# EAGLE design MB_Nano_V3_2 (EAGLE 9.5.2)
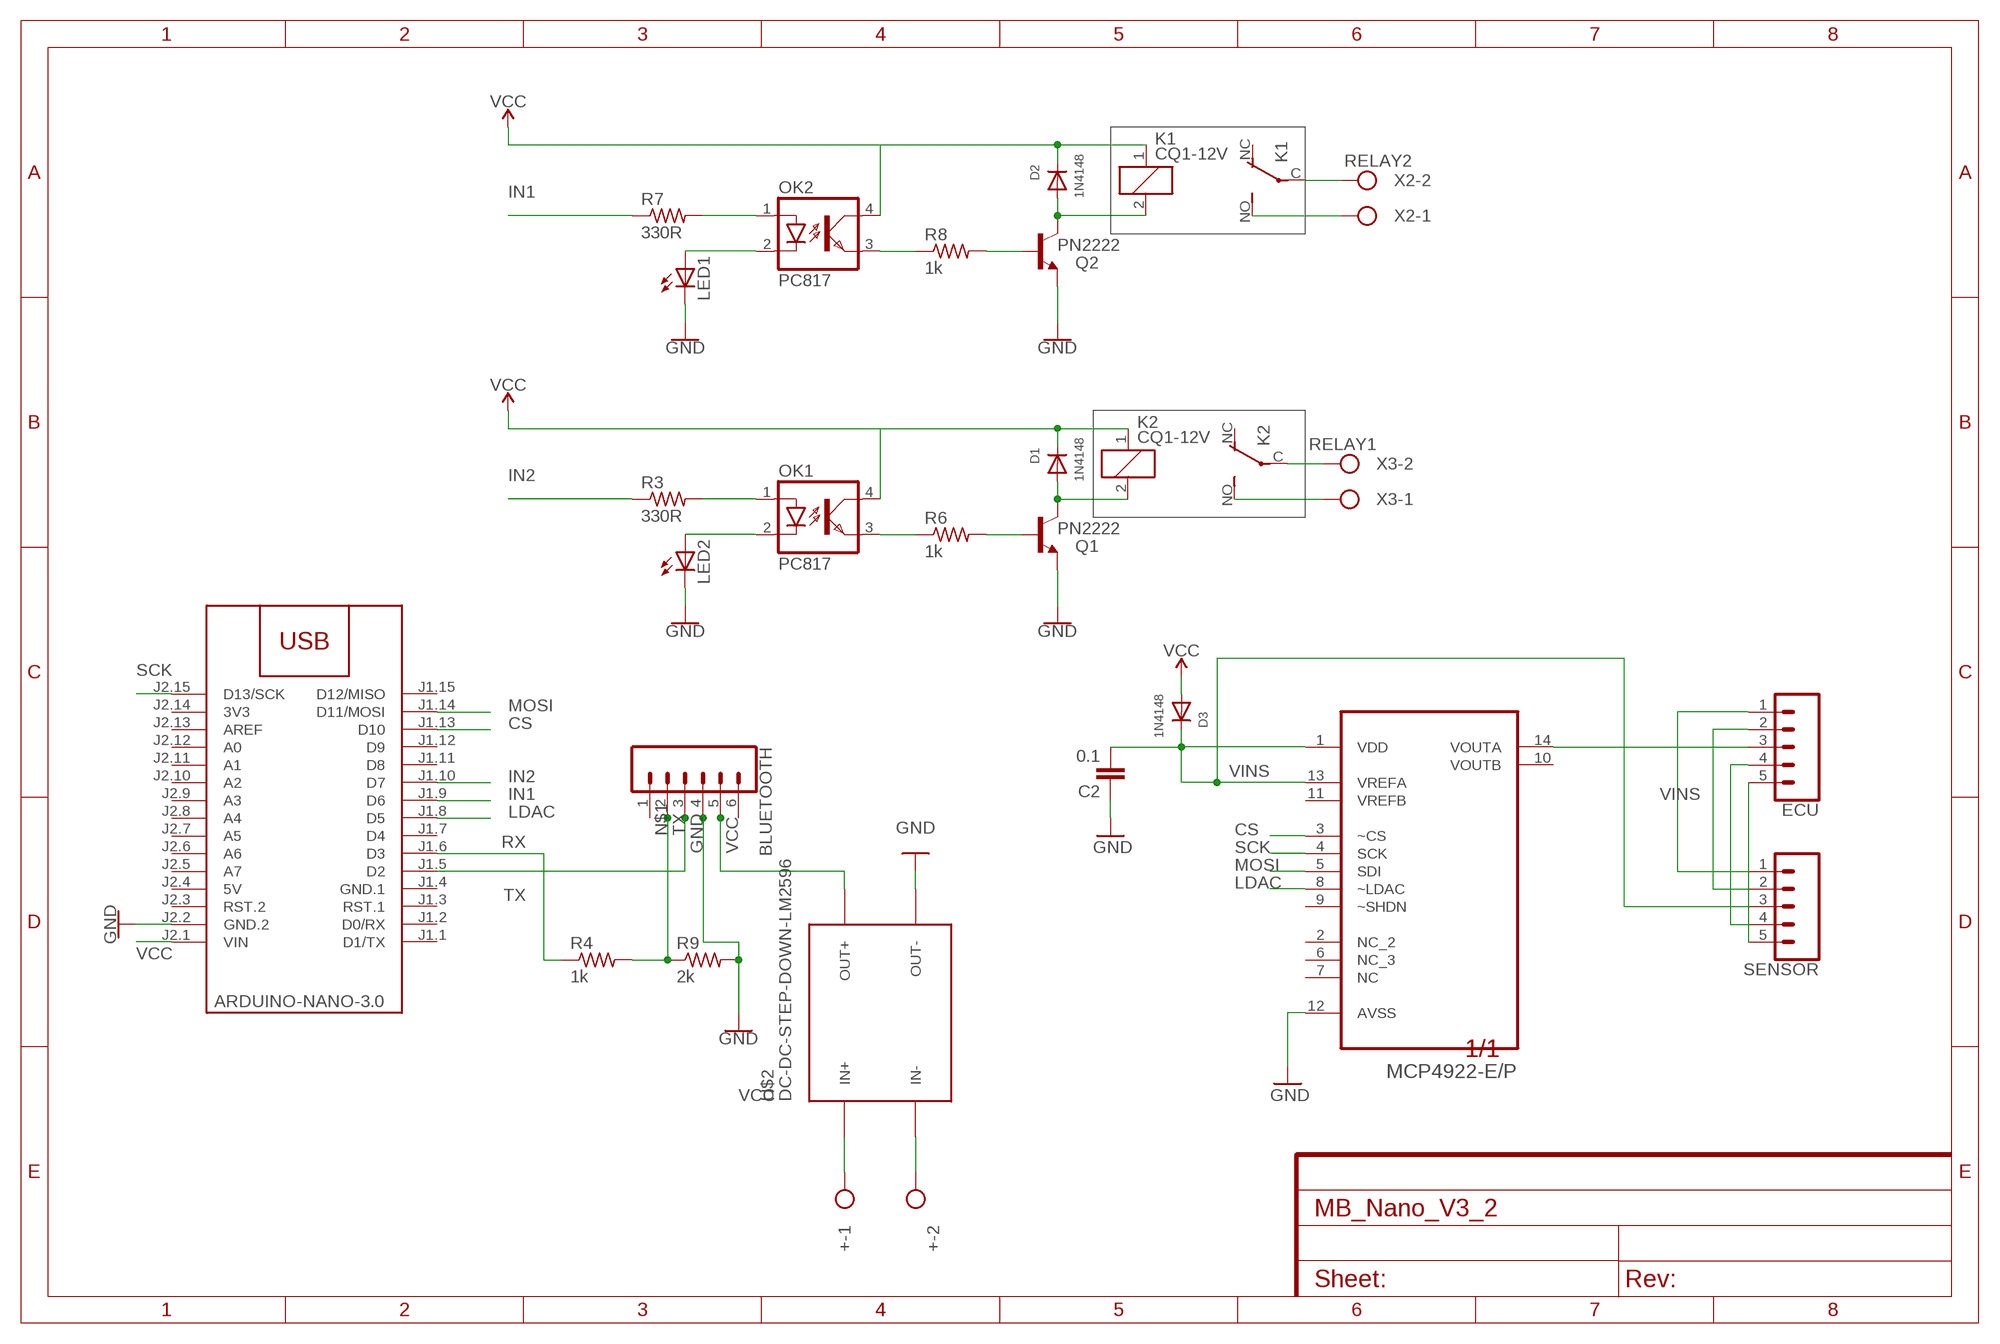
[diagram p0: schematic, sheet 1]

## Parts
+  Vcc  W237-102  [W237-102]
BLUETOOTH  CONN_06LONGPADS  [1X06_LONGPADS]
C2  0.1  CAPPTH1  [CAP-PTH-5MM]
D1  1N4148  DIODEDO-1N4148  [DO-1N4148]
D2  1N4148  DIODEDO-1N4148  [DO-1N4148]
D3  1N4148  DIODEDO-1N4148  [DO-1N4148]
ECU  CONN_05PTH_LONGPADS  [1X05_LONGPADS]
K1  CQ1-12V  [CQ1]
K2  CQ1-12V  [CQ1]
LED1  LED3MM  [LED3MM]
LED2  LED3MM  [LED3MM]
M2  ARDUINO-NANO-3.0  [ARDUINO-NANO-3.0]
OK1  PC817  [DIL04]
OK2  PC817  [DIL04]
Q1  PN2222  BC447  [TO92-EBC]
Q2  PN2222  BC447  [TO92-EBC]
R3  330R  R-US_0204/7  [0204/7]
R4  1k  R-US_0204/7  [0204/7]
R6  1k  R-US_0204/7  [0204/7]
R7  330R  R-US_0204/7  [0204/7]
R8  1k  R-US_0204/7  [0204/7]
R9  2k  R-US_0204/7  [0204/7]
SENSOR  CONN_05PTH_LONGPADS  [1X05_LONGPADS]
U$2  DC-DC-STEP-DOWN-LM2596  [DC-DC-STEP-DOWN-LM2596]
U$3  MCP4922-E/P  [DIP254P762X533-14]
X2  RELAY2  W237-102  [W237-102]
X3  RELAY1  W237-102  [W237-102]

## Nets
1: ECU.5 SENSOR.5
2: ECU.4 SENSOR.4
4: ECU.2 SENSOR.2
5: ECU.1 SENSOR.1
22: D2.A K1.2 Q2.C
+: +.1 U$2.IN+
-: +.2 U$2.IN-
CS: M2.J1.13(D10) U$3.3(~CS)
GND: BLUETOOTH.4 C2.1 LED1.K(C) LED2.K(C) M2.J2.2(GND.2) Q1.E Q2.E R9.2 U$2.OUT- U$3.12(AVSS)
GND-: D1.A K2.2 Q1.C
IN1: M2.J1.9(D6) R7.1
IN2: M2.J1.10(D7) R3.1
INS: OK1.1(A) R3.2
INSS: OK2.1(A) R7.2
LDAC: M2.J1.8(D5) U$3.8(~LDAC)
LED: LED2.A OK1.2(C)
LEDS: LED1.A OK2.2(C)
MOSI: M2.J1.14(D11/MOSI) U$3.5(SDI)
N$1: BLUETOOTH.2 R4.2 R9.1
N$2: K1.NO(2:S) X2.1
N$3: K1.C(2:P) X2.2
N$4: K2.NO(2:S) X3.1
N$5: K2.C(2:P) X3.2
N$12: Q1.B R6.2
N$20: Q2.B R8.2
N$22: OK2.3(EMIT) R8.1
OTP: OK1.3(EMIT) R6.1
RX: M2.J1.6(D3) R4.1
SCK: M2.J2.15(D13/SCK) U$3.4(SCK)
TX: BLUETOOTH.3 M2.J1.5(D2)
VCC: BLUETOOTH.5 D1.C D2.C D3.A K1.1 K2.1 M2.J2.1(VIN) OK1.4(COL) OK2.4(COL) U$2.OUT+
VINS: C2.2 D3.C SENSOR.3 U$3.1(VDD) U$3.13(VREFA)
VOUT: ECU.3 U$3.14(VOUTA)
Unconnected: BLUETOOTH.1 BLUETOOTH.6 K1.NC(2:O) K2.NC(2:O) M2.J1.1(D1/TX) M2.J1.2(D0/RX) M2.J1.3(RST.1) M2.J1.7(D4) M2.J1.11(D8) M2.J1.12(D9) M2.J1.15(D12/MISO) M2.J2.3(RST.2) M2.J2.5(A7) M2.J2.6(A6) M2.J2.7(A5) M2.J2.8(A4) M2.J2.9(A3) M2.J2.10(A2) M2.J2.11(A1) M2.J2.12(A0) M2.J2.13(AREF) U$3.2(NC_2) U$3.6(NC_3) U$3.7(NC) U$3.9(~SHDN) U$3.10(VOUTB) U$3.11(VREFB)

## Power pins joined to a net without a drawn wire
3V3: M2.J2.14(3V3)
5V: M2.J2.4(5V)
GND.1: M2.J1.4(GND.1)

## Library data of the parts
+ X2 X3 = con-wago-500:W237-102: WAGO SCREW CLAMP; MPN: 237-102; OC_FARNELL: unknown; OC_NEWARK: 70K9898
BLUETOOTH = SparkFun-Connectors:CONN_06: Multi connection point. Often used as Generic Header-pin footprint for 0.1 inch spaced/style header connections On any of the 0.1 inch spaced packages, you can populate with these: Break Away Headers - Straight <https://www.sparkfun.com/products/116> (PRT-00116) Break Away Male Headers - Right Angle <https://www.sparkfun.com/products/553> (PRT-00553) Female Headers <https://www.sparkfun.com/products/115> (PRT-00115) Break Away Headers - Machine Pin <https://www.sparkfun.com/products/117> (PRT-00117) Break Away Female Headers - Swiss Machine Pin <https://www.sparkfun.com/products/743> (PRT-00743) Arduino Stackable Header - 6 Pin <https://www.sparkfun.com/products/9280> (PRT-09280) For SCREWTERMINALS and SPRING TERMINALS visit here: Screw Terimnals on SparkFun.com <https://www.sparkfun.com/search/results?term=Screw+Terminals> (5mm/3.5mm/2.54mm spacing) This device is also useful as a general connection point to wire up your design to another part of your project. Our various solder wires solder well into these plated through hole pads. Hook-Up Wire - Assortment (Stranded, 22 AWG) <https://www.sparkfun.com/products/11375> (PRT-11375) Hook-Up Wire - Assortment (Solid Core, 22 AWG) <https://www.sparkfun.com/products/11367> (PRT-11367) View the entire wire category on our website here <https://www.sparkfun.com/categories/141>
C2 = SparkFun-Passives:CAP: Capacitor Standard 0603 ceramic capacitor, and 0.1" leaded capacitor.
D1-D3 = adafruit:DIODE: Diode SMADIODE - SMA Surface Mount Package 20V 1A Schottky Diode Digikey: 641-1014-6-ND DO-1N4148 - Through Hole Small Current Diode SOD-123 20V 1 A (.5mV Vf) Schottky Diode - Digikey: MBRX120TPMSCT-ND SOD-323 10V 570mA (.38mV Vf, 3ns) Schottky Diode - Digikey: ZLLS410CT-ND SOD-523 30V 30mA Schottky Diode (RB751S-40TE61) - Digikey: RB751S-40TE61CT-ND SOT23-R/W - SOT23 Package (R = Solder Paste/Reflow Ovens, W = Hand-Soldering) BAT54Film 40V 300mA - Digikey: 497-7162-1-ND
ECU SENSOR = SparkFun-Connectors:CONN_05: Multi connection point. Often used as Generic Header-pin footprint for 0.1 inch spaced/style header connections On any of the 0.1 inch spaced packages, you can populate with these: Break Away Headers - Straight <https://www.sparkfun.com/products/116> (PRT-00116) Break Away Male Headers - Right Angle <https://www.sparkfun.com/products/553> (PRT-00553) Female Headers <https://www.sparkfun.com/products/115> (PRT-00115) Break Away Headers - Machine Pin <https://www.sparkfun.com/products/117> (PRT-00117) Break Away Female Headers - Swiss Machine Pin <https://www.sparkfun.com/products/743> (PRT-00743) For SCREWTERMINALS and SPRING TERMINALS visit here: Screw Terimnals on SparkFun.com <https://www.sparkfun.com/search/results?term=Screw+Terminals> (5mm/3.5mm/2.54mm spacing) This device is also useful as a general connection point to wire up your design to another part of your project. Our various solder wires solder well into these plated through hole pads. Hook-Up Wire - Assortment (Stranded, 22 AWG) <https://www.sparkfun.com/products/11375> (PRT-11375) Hook-Up Wire - Assortment (Solid Core, 22 AWG) <https://www.sparkfun.com/products/11367> (PRT-11367) View the entire wire category on our website here <https://www.sparkfun.com/categories/141> Special notes: Molex polarized connector foot print use with SKU : PRT-08231 with associated crimp pins and housings. 1MM SMD Version SKU: PRT-10208
K1 K2 = relay5vdc:CQ1-12V: AUTOMOTIVE QUIET RELAY NAiS Source: http://www.mew-europe.com/.. en_ds_61208_0000.pdf; OC_FARNELL: unknown; OC_NEWARK: unknown
LED1 LED2 = adafruit:LED: LED OSRAM: - CHIPLED LG R971, LG N971, LY N971, LG Q971, LY Q971, LO R971, LY R971 LH N974, LH R974 LS Q976, LO Q976, LY Q976 LO Q996 - Hyper CHIPLED LW Q18S LB Q993, LB Q99A, LB R99A - SideLED LS A670, LO A670, LY A670, LG A670, LP A670 LB A673, LV A673, LT A673, LW A673 LH A674 LY A675 LS A676, LA A676, LO A676, LY A676, LW A676 LS A679, LY A679, LG A679 - Hyper Micro SIDELED® LS Y876, LA Y876, LO Y876, LY Y876 LT Y87S - SmartLED LW L88C, LW L88S LB L89C, LB L89S, LG L890 LS L89K, LO L89K, LY L89K LS L896, LA L896, LO L896, LY L896 - TOPLED LS T670, LO T670, LY T670, LG T670, LP T670 LSG T670, LSP T670, LSY T670, LOP T670, LYG T670 LG T671, LOG T671, LSG T671 LB T673, LV T673, LT T673, LW T673 LH T674 LS T676, LA T676, LO T676, LY T676, LB T676, LH T676, LSB T676, LW T676 LB T67C, LV T67C, LT T67C, LS T67K, LO T67K, LY T67K, LW E67C LS E67B, LA E67B, LO E67B, LY E67B, LB E67C, LV E67C, LT E67C LW T67C LS T679, LY T679, LG T679 LS T770, LO T770, LY T770, LG T770, LP T770 LB T773, LV T773, LT T773, LW T773 LH T774 LS E675, LA E675, LY E675, LS T675 LS T776, LA T776, LO T776, LY T776, LB T776 LHGB T686 LT T68C, LB T68C - Hyper Mini TOPLED® LB M676 - Mini TOPLED Santana® LG M470 LS M47K, LO M47K, LY M47K Source: http://www.osram.convergy.de/
M2 = diy-modules:ARDUINO-NANO-3.0: Arduino Nano 3.0 and compatible devices More details available here: https://www.arduino.cc/en/Main/ArduinoBoardNano Click here to find device on ebay.com <http://www.ebay.com/sch/arduino+nano>
OK1 OK2 = optocoupler:PC817: SHARP OPTO COUPLER; MPN: PC817X4J000F; OC_FARNELL: 9707727; OC_NEWARK: 97K7059
Q1 Q2 = transistor-npn:BC447*: NPN Transistor
R3 R4 R6-R9 = adafruit:R-US_: RESISTOR, American symbol
U$2 = diy-modules:DC-DC-STEP-DOWN-LM2596: DC/DC Step-Down Regulator based on LM2596-ADJ chip LM2596 datasheet available here: http://www.ti.com/lit/ds/symlink/lm2596.pdf Click here to find device on ebay.com <http://www.ebay.com/sch/lm2596+power+regulator>
U$3 = Microchip_By_element14_Batch_1:MCP4922-E/P: 12-Bit DAC; MPN: MCP4922-E/P; OC_FARNELL: 1292244; OC_NEWARK: 61K2950; PACKAGE: DIP-14; SUPPLIER: Microchip

## Board
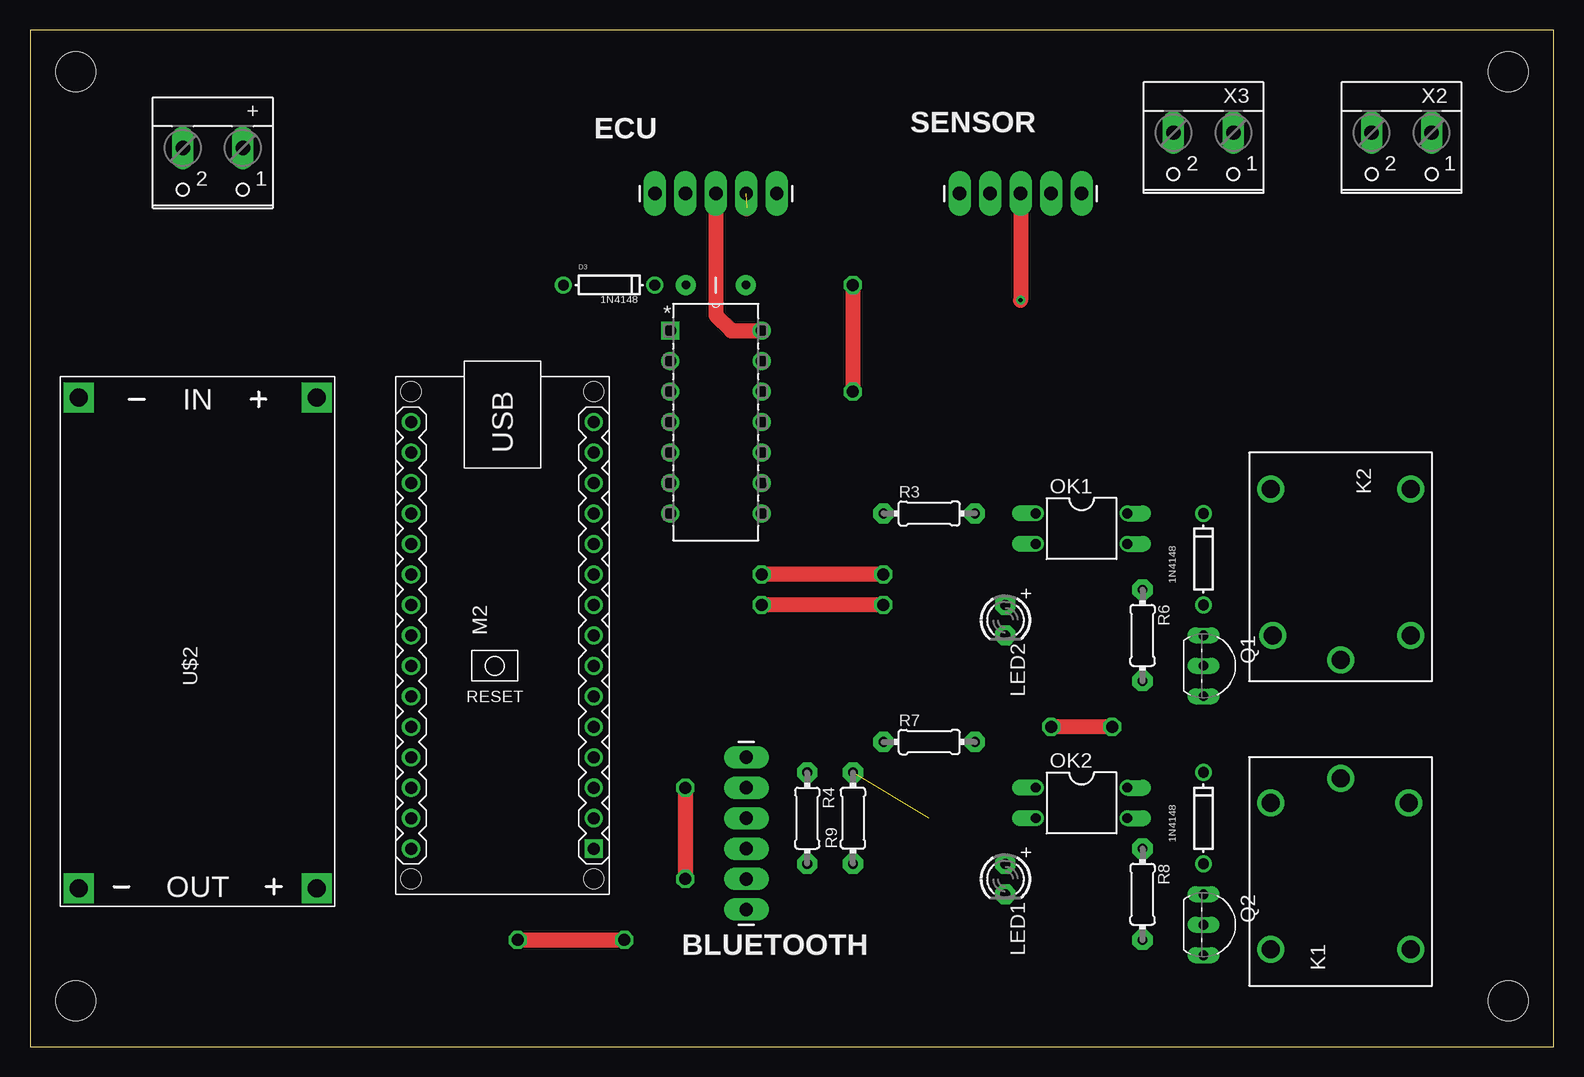
[diagram p1: board, top side]
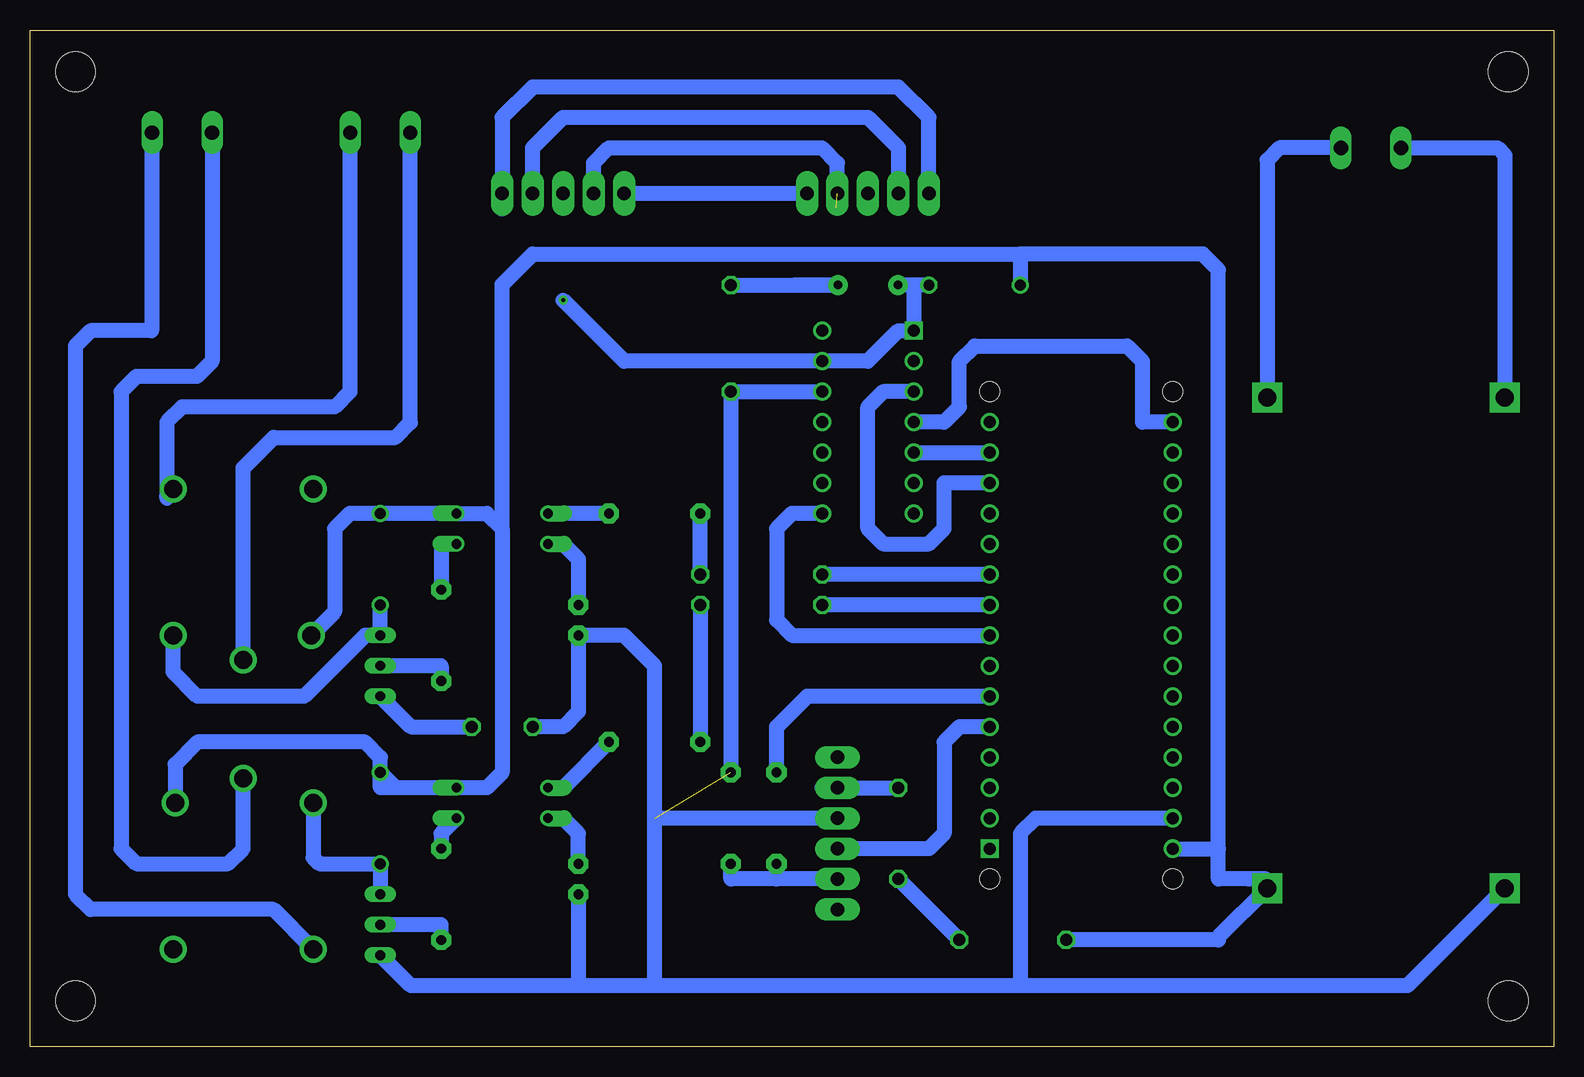
[diagram p2: board, bottom side, seen from below]

Size 126.98 x 84.76 mm. Coordinates in mm from the lower left corner, seen from the top.
Outline: 0,0 126.98,0 126.98,84.76 0,84.76 0,0
Copper layers (1*16): Top 0.035mm / dielectric 1.5mm / Bottom 0.035mm
Design rules "default": minimum track width 6mil, minimum drill 0.35mm, track to track 6mil, track to pad 6mil, pad to pad 6mil, via to via 6mil, smd to smd 6mil, copper to edge 40mil, drill to drill 6mil, minimum pad ring 10mil, minimum via ring 8mil, stop-mask expansion 4mil, vias tented up to drill 0mil, thermal gap 10mil
Holes 3.31 mm at 3.81,3.81 3.81,81.28 123.19,3.81 123.19,81.28

### Footprints (pad centres in the part's own frame; a part is rotated, then mirrored left to right if it is on the bottom)
W237-102 = drill 1.194 long: 1 -2.5,-1.27; 2 2.5,-1.27
1X06_LONGPADS = drill 1.118 pad 1.88 long: 1 0,0; 2 2.54,0; 3 5.08,0; 4 7.62,0; 5 10.16,0; 6 12.7,0
CAP-PTH-5MM = drill 0.7 pad 1.651: 1 -2.5,0; 2 2.5,0
DO-1N4148 = drill 0.9: A -3.81,0; C 3.81,0
1X05_LONGPADS = drill 1.118 pad 1.88 long: 1 0,0; 2 2.54,0; 3 5.08,0; 4 7.62,0; 5 10.16,0
CQ1 = drill 1.5: 1 5.08,-5.66; 2 5.08,5.842; C 7.112,0; NC -7.112,-5.842; NO -7.112,5.842
LED3MM = drill 0.813 pad 1.676 octagon: A -1.27,0; K 1.27,0
ARDUINO-NANO-3.0 = drill 1 square: J1.1 17.78,7.62 | drill 1: J1.2 15.24,7.62; J1.3 12.7,7.62; J1.4 10.16,7.62; J1.5 7.62,7.62; J1.6 5.08,7.62; J1.7 2.54,7.62; J1.8 0,7.62; J1.9 -2.54,7.62; J1.10 -5.08,7.62; J1.11 -7.62,7.62; J1.12 -10.16,7.62; J1.13 -12.7,7.62; J1.14 -15.24,7.62; J1.15 -17.78,7.62; J2.1 17.78,-7.62; J2.2 15.24,-7.62; J2.3 12.7,-7.62; J2.4 10.16,-7.62; J2.5 7.62,-7.62; J2.6 5.08,-7.62; J2.7 2.54,-7.62; J2.8 0,-7.62; J2.9 -2.54,-7.62; J2.10 -5.08,-7.62; J2.11 -7.62,-7.62; J2.12 -10.16,-7.62; J2.13 -12.7,-7.62; J2.14 -15.24,-7.62; J2.15 -17.78,-7.62 | hole 1.651: -20.32,7.62; -20.32,-7.62; 20.32,-7.62; 20.32,7.62
DIL04 = drill 0.813 offset: 1 -1.27,-3.81; 2 1.27,-3.81; 3 1.27,3.81; 4 -1.27,3.81
TO92-EBC = drill 0.813 long: B 0,-1.27; C -2.54,-1.27; E 2.54,-1.27
0204/7 = drill 0.813 pad 1.676 octagon: 1 -3.81,0; 2 3.81,0
DC-DC-STEP-DOWN-LM2596 = drill 1.5 pad 2.5 square: IN+ -22.352,8.636; IN- -22.352,-11.176; OUT+ 18.542,8.636; OUT- 18.542,-11.176
DIP254P762X533-14 = drill 0.991 square: 1 -7.62,15.24 | drill 0.991: 2 -7.62,12.7; 3 -7.62,10.16; 4 -7.62,7.62; 5 -7.62,5.08; 6 -7.62,2.54; 7 -7.62,0; 8 0,0; 9 0,2.54; 10 0,5.08; 11 0,7.62; 12 0,10.16; 13 0,12.7; 14 0,15.24

### Placement (x,y rotation side)
+  15.24,73.66 180 top
BLUETOOTH  59.69,11.43 90 top
C2  57.15,63.5 180 top
D1  97.79,40.64 90 top
D2  97.79,19.05 90 top
D3  48.26,63.5 0 top
ECU  52.07,71.12 0 top
K1  109.22,15.24 90 top
K2  109.22,39.37 270 top
LED1  81.28,13.97 270 top
LED2  81.28,35.56 270 top
M2  39.37,34.29 270 top
OK1  87.63,43.18 270 top
OK2  87.63,20.32 270 top
Q1  99.06,31.75 270 top
Q2  99.06,10.16 270 top
R3  74.93,44.45 0 top
R4  64.77,19.05 270 top
R6  92.71,34.29 270 top
R7  74.93,25.4 0 top
R8  92.71,12.7 270 top
R9  68.58,19.05 90 top
SENSOR  87.63,71.12 180 top
U$2  15.24,31.75 270 top
U$3  60.96,44.45 0 top
X2  114.3,74.93 180 top
X3  97.79,74.93 180 top

### Tracks (layer width: path | path; a pad name or v marks a point on that pad's centre or on a via)
1
  Bottom 1.27: ECU.5 SENSOR.5
2  (1 unrouted)
  Top 0.152: 79.91,71.12 79.91,71.22 SENSOR.4 | 59.79,71.22 ECU.4
  Top 1.27: 59.69,69.85 59.79,69.95
  Bottom 1.27: ECU.4 59.69,73.66 60.96,74.93 78.74,74.93 80.01,73.66 SENSOR.4
4
  Bottom 1.27: SENSOR.2 85.09,74.93 82.55,77.47 57.15,77.47 54.61,74.93 ECU.2
5
  Bottom 1.27: ECU.1 52.07,77.47 54.61,80.01 85.09,80.01 87.63,77.47 SENSOR.1 87.63,69.85
22
  Bottom 1.27: Q2.C D2.A 102.87,15.24 103.38,15.75 K1.2
+
  Bottom 1.27: +.1 22.86,74.93 23.88,73.91 U$2.IN+
-
  Bottom 1.27: +.2 4.68,74.93 4.06,74.32 U$2.IN-
CS
  Bottom 1.27: M2.J1.13 50.8,46.99 50.8,43.18 52.07,41.91 55.88,41.91 57.15,43.18 57.15,53.34 55.88,54.61 U$3.3
GND  (via drill 1)  (1 unrouted)
  Top 1.27: v90.17,26.67 v85.09,26.67 | v68.58,63.5 v68.58,54.61
  Bottom 1.27: Q1.E 95.25,26.67 v90.17,26.67 | U$3.12 v68.58,54.61 R9.2 | M2.J2.2 43.18,19.05 44.45,17.78 44.45,5.08 | v85.09,26.67 82.55,26.67 81.28,27.94 LED2.K 77.47,34.29 74.93,31.75 74.93,19.05 | BLUETOOTH.4 74.93,19.05 | 63.23,63.5 C2.1 v68.58,63.5 | 74.93,5.08 74.93,19.05 | 44.45,5.08 74.93,5.08 | 74.93,5.08 81.28,5.08 | 81.28,5.08 95.25,5.08 Q2.E | LED1.K 81.28,5.08 | U$2.OUT- 12.19,5.08 44.45,5.08
GND-
  Bottom 1.27: D1.A Q1.C 99.06,34.29 104.14,29.21 113.03,29.21 115.06,31.24 K2.2
IN1  (via drill 1)
  Top 1.27: v71.12,36.83 v60.96,36.83
  Bottom 1.27: v71.12,36.83 R7.1 | M2.J1.9 v60.96,36.83
IN2  (via drill 1)
  Top 1.27: v71.12,39.37 v60.96,39.37
  Bottom 1.27: v71.12,39.37 R3.1 | M2.J1.10 v60.96,39.37
INS
  Bottom 1.27: R3.2 OK1.1
INSS
  Bottom 1.27: OK2.1 82.55,21.59 R7.2
LDAC
  Bottom 1.27: M2.J1.8 63.5,34.29 64.77,35.56 64.77,43.18 63.5,44.45 U$3.8
LED
  Bottom 1.27: OK1.2 82.55,41.91 81.28,40.64 LED2.A
LEDS
  Bottom 1.27: LED1.A 81.28,17.78 82.55,19.05 OK2.2
MOSI
  Bottom 1.27: U$3.5 M2.J1.14
N$1
  Bottom 1.27: BLUETOOTH.2 64.77,13.97 | 64.77,13.97 68.58,13.97 R9.1 | R4.2 64.77,13.97
N$2
  Bottom 1.27: K1.NO 106.68,11.43 121.92,11.43 123.19,12.7 123.19,58.42 121.92,59.69 116.84,59.69 116.84,76.16 X2.1 116.8,68.62
N$3
  Bottom 1.27: X2.2 111.8,57.15 113.07,55.88 118.11,55.88 119.38,54.61 119.38,16.51 118.11,15.24 110.49,15.24 109.22,16.51 K1.C
N$4
  Bottom 1.27: 115.57,45.72 115.57,45.97 | 115.57,45.97 K2.NO | 115.57,45.97 115.57,52.07 114.3,53.34 101.6,53.34 100.33,54.61 100.33,76.16 X3.1
N$5
  Bottom 1.27: K2.C 109.22,48.26 106.68,50.8 96.52,50.8 95.29,52.03 X3.2
N$12
  Bottom 1.27: Q1.B 92.71,31.75 R6.2
N$20
  Bottom 1.27: R8.2 92.71,10.16 Q2.B
N$22
  Bottom 1.27: R8.1 92.71,17.78 OK2.3
OTP
  Bottom 1.27: OK1.3 92.71,41.91 R6.1
RX
  Bottom 1.27: M2.J1.6 62.23,29.21 64.77,26.67 R4.1
SCK
  Bottom 1.27: 31.69,52.13 M2.J2.15 34.29,52.07 34.29,57.15 35.56,58.42 48.26,58.42 49.53,57.15 49.53,53.34 50.8,52.07 U$3.4
TX
  Bottom 1.27: BLUETOOTH.3 52.07,16.51 50.8,17.78 50.8,25.4 49.53,26.67 M2.J1.5
VCC  (via drill 1)
  Top 1.27: v40.64,8.89 v49.53,8.89 | v54.61,21.59 v54.61,13.97
  Bottom 1.27: 96.52,21.59 OK2.4 88.9,21.59 87.63,22.86 87.63,43.18 | D2.C 96.52,21.59 | M2.J2.1 27.94,16.51 | 25.4,13.97 23.96,13.97 U$2.OUT+ | 87.63,43.18 88.9,44.45 OK1.4 D1.C 100.33,44.45 101.6,43.18 101.6,36.25 K2.1 | 60.96,21.59 BLUETOOTH.5 v54.61,21.59 | v40.64,8.89 27.94,8.89 27.94,9.14 U$2.OUT+ | 96.52,21.59 97.79,21.59 D2.C | D2.C 97.79,24.13 99.06,25.4 113.03,25.4 114.88,23.55 K1.1 | 27.94,16.51 27.94,64.77 29.21,66.04 29.21,66.08 44.45,66.08 | 44.45,66.08 85.09,66.08 87.63,63.54 87.63,43.18 | 44.45,66.08 D3.A | v54.61,13.97 v49.53,8.89 | U$2.OUT+ 24.38,13.97 27.94,13.97 27.94,16.51
VINS  (via drill 0.35, 0.9)
  Top 1.27: SENSOR.3 v82.55,62.23
  Bottom 1.27: 53.34,63.5 C2.2 | 53.34,63.5 U$3.1 54.61,59.69 57.15,57.15 U$3.13 77.47,57.15 v82.55,62.23 | D3.C 53.34,63.5
  other vias: 52.07,63.5
VOUT
  Top 1.27: ECU.3 57.15,60.96 58.42,59.69 U$3.14